# Altium schematic sheet CurrentSense.SchDoc
size A4
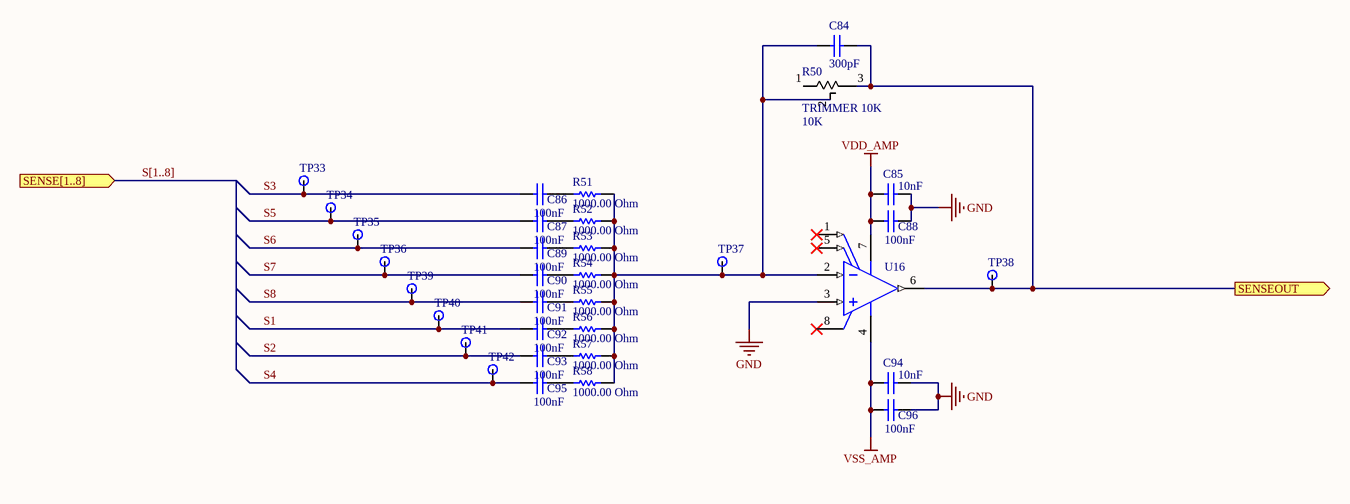
[diagram p0: CurrentSense.SchDoc]

## Parts
C84  value 300pF  [CAPC0603(1608)100_N]  (hidden comment: CAP 300pF 25V 0603(1608))
C85  value 10nF  [CAPC0603(1608)100_N]  (hidden comment: CAP 10nF 25V 0603(1608))
C86  value 100nF  [CAPC0603(1608)100_M]  (hidden comment: CAP 100nF 25V 0603(1608))
C87  value 100nF  [CAPC0603(1608)100_M]  (hidden comment: CAP 100nF 25V 0603(1608))
C88  value 100nF  [CAPC0603(1608)100_M]  (hidden comment: CAP 100nF 25V 0603(1608))
C89  value 100nF  [CAPC0603(1608)100_M]  (hidden comment: CAP 100nF 25V 0603(1608))
C90  value 100nF  [CAPC0603(1608)100_M]  (hidden comment: CAP 100nF 25V 0603(1608))
C91  value 100nF  [CAPC0603(1608)100_M]  (hidden comment: CAP 100nF 25V 0603(1608))
C92  value 100nF  [CAPC0603(1608)100_M]  (hidden comment: CAP 100nF 25V 0603(1608))
C93  value 100nF  [CAPC0603(1608)100_M]  (hidden comment: CAP 100nF 25V 0603(1608))
C94  value 10nF  [CAPC0603(1608)100_N]  (hidden comment: CAP 10nF 25V 0603(1608))
C95  value 100nF  [CAPC0603(1608)100_M]  (hidden comment: CAP 100nF 25V 0603(1608))
C96  value 100nF  [CAPC0603(1608)100_M]  (hidden comment: CAP 100nF 25V 0603(1608))
R50  TRIMMER 10K  value 10K  [TRIMMER 10K]
R51  value 1000.00 Ohm  [RESC0603(1608)_L]  (hidden comment: 1K 5% 0603(1608))
R52  value 1000.00 Ohm  [RESC0603(1608)_L]  (hidden comment: 1K 5% 0603(1608))
R53  value 1000.00 Ohm  [RESC0603(1608)_L]  (hidden comment: 1K 5% 0603(1608))
R54  value 1000.00 Ohm  [RESC0603(1608)_L]  (hidden comment: 1K 5% 0603(1608))
R55  value 1000.00 Ohm  [RESC0603(1608)_L]  (hidden comment: 1K 5% 0603(1608))
R56  value 1000.00 Ohm  [RESC0603(1608)_L]  (hidden comment: 1K 5% 0603(1608))
R57  value 1000.00 Ohm  [RESC0603(1608)_L]  (hidden comment: 1K 5% 0603(1608))
R58  value 1000.00 Ohm  [RESC0603(1608)_L]  (hidden comment: 1K 5% 0603(1608))
TP33  Testpoint  [0603 PROBE PAD]  (value not drawn)
TP34  Testpoint  [0603 PROBE PAD]  (value not drawn)
TP35  Testpoint  [0603 PROBE PAD]  (value not drawn)
TP36  Testpoint  [0603 PROBE PAD]  (value not drawn)
TP37  Testpoint  [0603 PROBE PAD]  (value not drawn)
TP38  Testpoint  [0603 PROBE PAD]  (value not drawn)
TP39  Testpoint  [0603 PROBE PAD]  (value not drawn)
TP40  Testpoint  [0603 PROBE PAD]  (value not drawn)
TP41  Testpoint  [0603 PROBE PAD]  (value not drawn)
TP42  Testpoint  [0603 PROBE PAD]  (value not drawn)
U16  TL081CDG4  [TI-D8_N]  (value not drawn)

## Ports
SENSE[1..8] (in), SENSEOUT (out)

## Nets
GND: C85.2 C88.1 C94.2 C96.1 U16.3(IN+)
VDD_AMP: C85.1 C88.2 U16.7(VCC+)
VSS_AMP: C94.1 C96.2 U16.4(VCC-)
S1: C92.2 TP40.0
S2: C93.2 TP41.0
S3: C86.2 TP33.0
S4: C95.2 TP42.0
S5: C87.2 TP34.0
S6: C89.2 TP35.0
S7: C90.2 TP36.0
S8: C91.2 TP39.0
SENSEOUT: C84.1 R50.3 TP38.0 U16.6(OUT) ; port SENSEOUT
NetC84_2: C84.2 R50.2 R51.1 R52.1 R53.1 R54.1 R55.1 R56.1 R57.1 R58.1 TP37.0 U16.2(IN-)
NetC86_1: C86.1 R51.2
NetC87_1: C87.1 R52.2
NetC89_1: C89.1 R53.2
NetC90_1: C90.1 R54.2
NetC91_1: C91.1 R55.2
NetC92_1: C92.1 R56.2
NetC93_1: C93.1 R57.2
NetC95_1: C95.1 R58.2

Not connected (* = marked no-connect by the designer): R50 1; U16 1(OFFSET_N1)* 5(OFFSET_N2)* 8(NC)*

## Buses and harness runs
bus S[1..8] = port SENSE[1..8]

## Library data of the parts
C84 = CMP-1035-01546-1: CAP 300pF 25V ±10% 0603 (1608 Metric) Thickness 1mm SMD; Tolerance: Â±10%; Case-EIA: 0603; Case-Metric: 1608; Rated Voltage: 25 V; Technology: SMT; Max Thickness: 1 mm
C85 C94 = CMP-1035-02317-1: CAP 10nF 25V ±10% 0603 (1608 Metric) Thickness 1mm SMD; Tolerance: Â±10%; Case-Metric: 1608; Case-EIA: 0603; Max Thickness: 1 mm; Rated Voltage: 25 V; Technology: SMT; OrderURL: http://www.digikey.ie/product-detail/en/yageo/CC0603KRX7R8BB103/311-1360-1-ND/2103144; Supplier 1: Digi-Key; Supplier Part Number 1: 311-1360-1-ND
C86-C93 C95 C96 = CMP-1035-02588-1: CAP 100nF 25V ±10% 0603 (1608 Metric) Thickness 1mm SMD; Case-Metric: 1608; Case-EIA: 0603; Tolerance: Â±10%; Max Thickness: 1 mm; Technology: SMT; Rated Voltage: 25 V; OrderURL: http://www.digikey.ie/product-detail/en/yageo/CC0603KRX7R8BB104/311-1341-1-ND/2103125; Supplier 1: Digi-Key; Supplier Part Number 1: 311-1341-1-ND
R50 = TRIMMER 10K: TRIMMER 10K OHM 0.5W TH; Manufacturer: TE Connectivity Passive Product; Manufacturer Part Number: 1-1623849-0; Power (Watts): 0.5W, 1/2W; Tolerance: ±10%; Temperature Coefficient: ±100ppm/°C; Number of Turns: 25; Adjustment Type: Top Adjustment; Resistive Material: Cermet; Published: 8-Jun-2000; LatestRevisionDate: 29-May-2009; LatestRevisionNote: IPC-7351 Footprint Added.; PackageReference: J1-0603; Publisher: Altium Limited; PackageDescription: Chip Resistor; RoHS: RoHS Compliant; Category: Potentiometers, Variable Resistors; Packaging: Bulk; Part Status: Active; Resistance (Ohms): 10k; Mounting Type: Through Hole; Termination Style: PC Pins; Size / Dimension: Rectangular - 0.374" x 0.185" Face x 0.394" H (9.50mm x 4.70mm x 10.00mm); ComponentLink1URL: http://www.te.com/commerce/DocumentDelivery/DDEController?Action=srchrtrv&DocNm=1623849&DocType=Customer+Drawing&DocLang=English; ComponentLink1Description: http://www.te.com/commerce/DocumentDelivery/DDEController?Action=srchrtrv&DocNm=1623849&DocType=Customer+Drawing&DocLang=English; Supplier 1: Digi-Key; Supplier Part Number 1: A105870-ND; Stock 1: 5809; Pricing 1: 1=0.89, 10=0.786, 25=0.7076, 50=0.6816, 100=0.6554, 250=0.61608, 500=0.5243, 1000=0.48499, 5000=0.39848 (EUR)
R51-R58 = CMP-1012-00074-1: 1K 0.1W 5% 0603 (1608 Metric)  SMD; Case-EIA: 0603; Case-Metric: 1608; Technology: SMT; Tolerance: 5 %; Power: 0.1 W; OrderURL: http://www.digikey.ie/product-detail/en/yageo/RC0603JR-071KL/311-1.0KGRCT-ND/729624; Supplier 1: Digi-Key; Supplier Part Number 1: 311-1.0KGRCT-ND
TP33-TP42 = Testpoint: 0.063" x 0.031" x 0.045" (1.60mm x 0.80mm x 1.15mm); OrderURL: http://www.digikey.ie/product-detail/en/te-connectivity-amp-connectors/RCU-0C/A106145CT-ND/3477802; Value: *; Width: 0.8; Height: 1.15mm; Length: 1.60mm; Supplier Part Number 1: A106145CT-ND; Supplier 1: Digi-Key
U16 = CMP-0017-00506-1: JFET-Input Operational Amplifier, 7 to 36 V, 0 to 70 degC, 8-pin SOIC (D8), Green (RoHS & no Sb/Br); Manufacturer: Texas Instruments; Manufacturer Part Number: TL081CDR; Total Supply Voltage(Min)(+5V is 5, +/-5V is 10): 7; Rating: Military; CMRR(Min)(dB): 70; IIB(Max)(pA): 400; Iq per channel(Max)(mA): 2.8; Vio (25C)(Max)(mV): 15; Vn at 1kHz(Typ)(nV/rtHz): 18; Slew Rate(Typ)(V/us): 13; Sub Family: General Purpose Amplifier, High Supply Voltage Amplifier (>=30V); Total Supply Voltage(Max)(+5V is 5, +/-5V is 10): 36; Number of Channels: 1; GBW(Typ)(MHz): 3; Amplifier Type: J-FET; Slew Rate: 13 V/µs; Gain Bandwidth Product: 3MHz; Current - Input Bias: 30pA; Voltage - Input Offset: 3mV; Current - Supply: 1.4mA; Voltage - Supply, Single/Dual (±): 7 V ~ 36 V, ±3.5 V ~ 18 V; ComponentLink3Description: Package Specification; Eco-Plan: Green (RoHS & no Sb/Br); PackageReference: D8; ComponentLink1Description: Manufacturer URL; PackageDescription: 8-Pin Plastic Small Outline, Body 4.9 x 3.9 mm, Pitch 1.27 mm; DatasheetVersion: SLOS081G; PackageVersion: 4040047-3/M, 06/2011; Code_JEDEC: MS-012; ComponentLink2URL: http://www.ti.com/lit/ds/symlink/tl081.pdf; ComponentLink1URL: http://www.ti.com/; Offset Drift(Typ)(uV/C): 18; Mounting Technology: Surface Mount; ComponentLink2Description: Datasheet; PartNumber: TL081CDG4; ComponentLink3URL: http://www.ti.com/litv/pdf/msoi002j; OrderURL: http://www.digikey.ie/product-detail/en/texas-instruments/TL081CDR/296-15001-1-ND/562657; Supplier 1: Digi-Key; Supplier Part Number 1: 296-15001-1-ND; RoHS: RoHS Compliant; Category: Integrated Circuits (ICs); Stock 1: 9909; Pricing 1: 1=0.44, 10=0.375, 100=0.28, 500=0.22002, 1000=0.17001 (EUR); Packaging: Cut Tape (CT); Part Status: Active; Number of Circuits: 1; Output Type: -; -3db Bandwidth: -; Current - Output / Channel: -; Operating Temperature: 0°C ~ 70°C; Mounting Type: Surface Mount; Package / Case: 8-SOIC (0.154", 3.90mm Width); Supplier Device Package: 8-SOIC; ComponentLink4URL: http://www.ti.com/lit/ds/symlink/tl081a.pdf; ComponentLink4Description: http://www.ti.com/lit/ds/symlink/tl081a.pdf